# EAGLE design BT AQ DOL R7 (EAGLE 9.6.2)

## Sheet 1 of 2
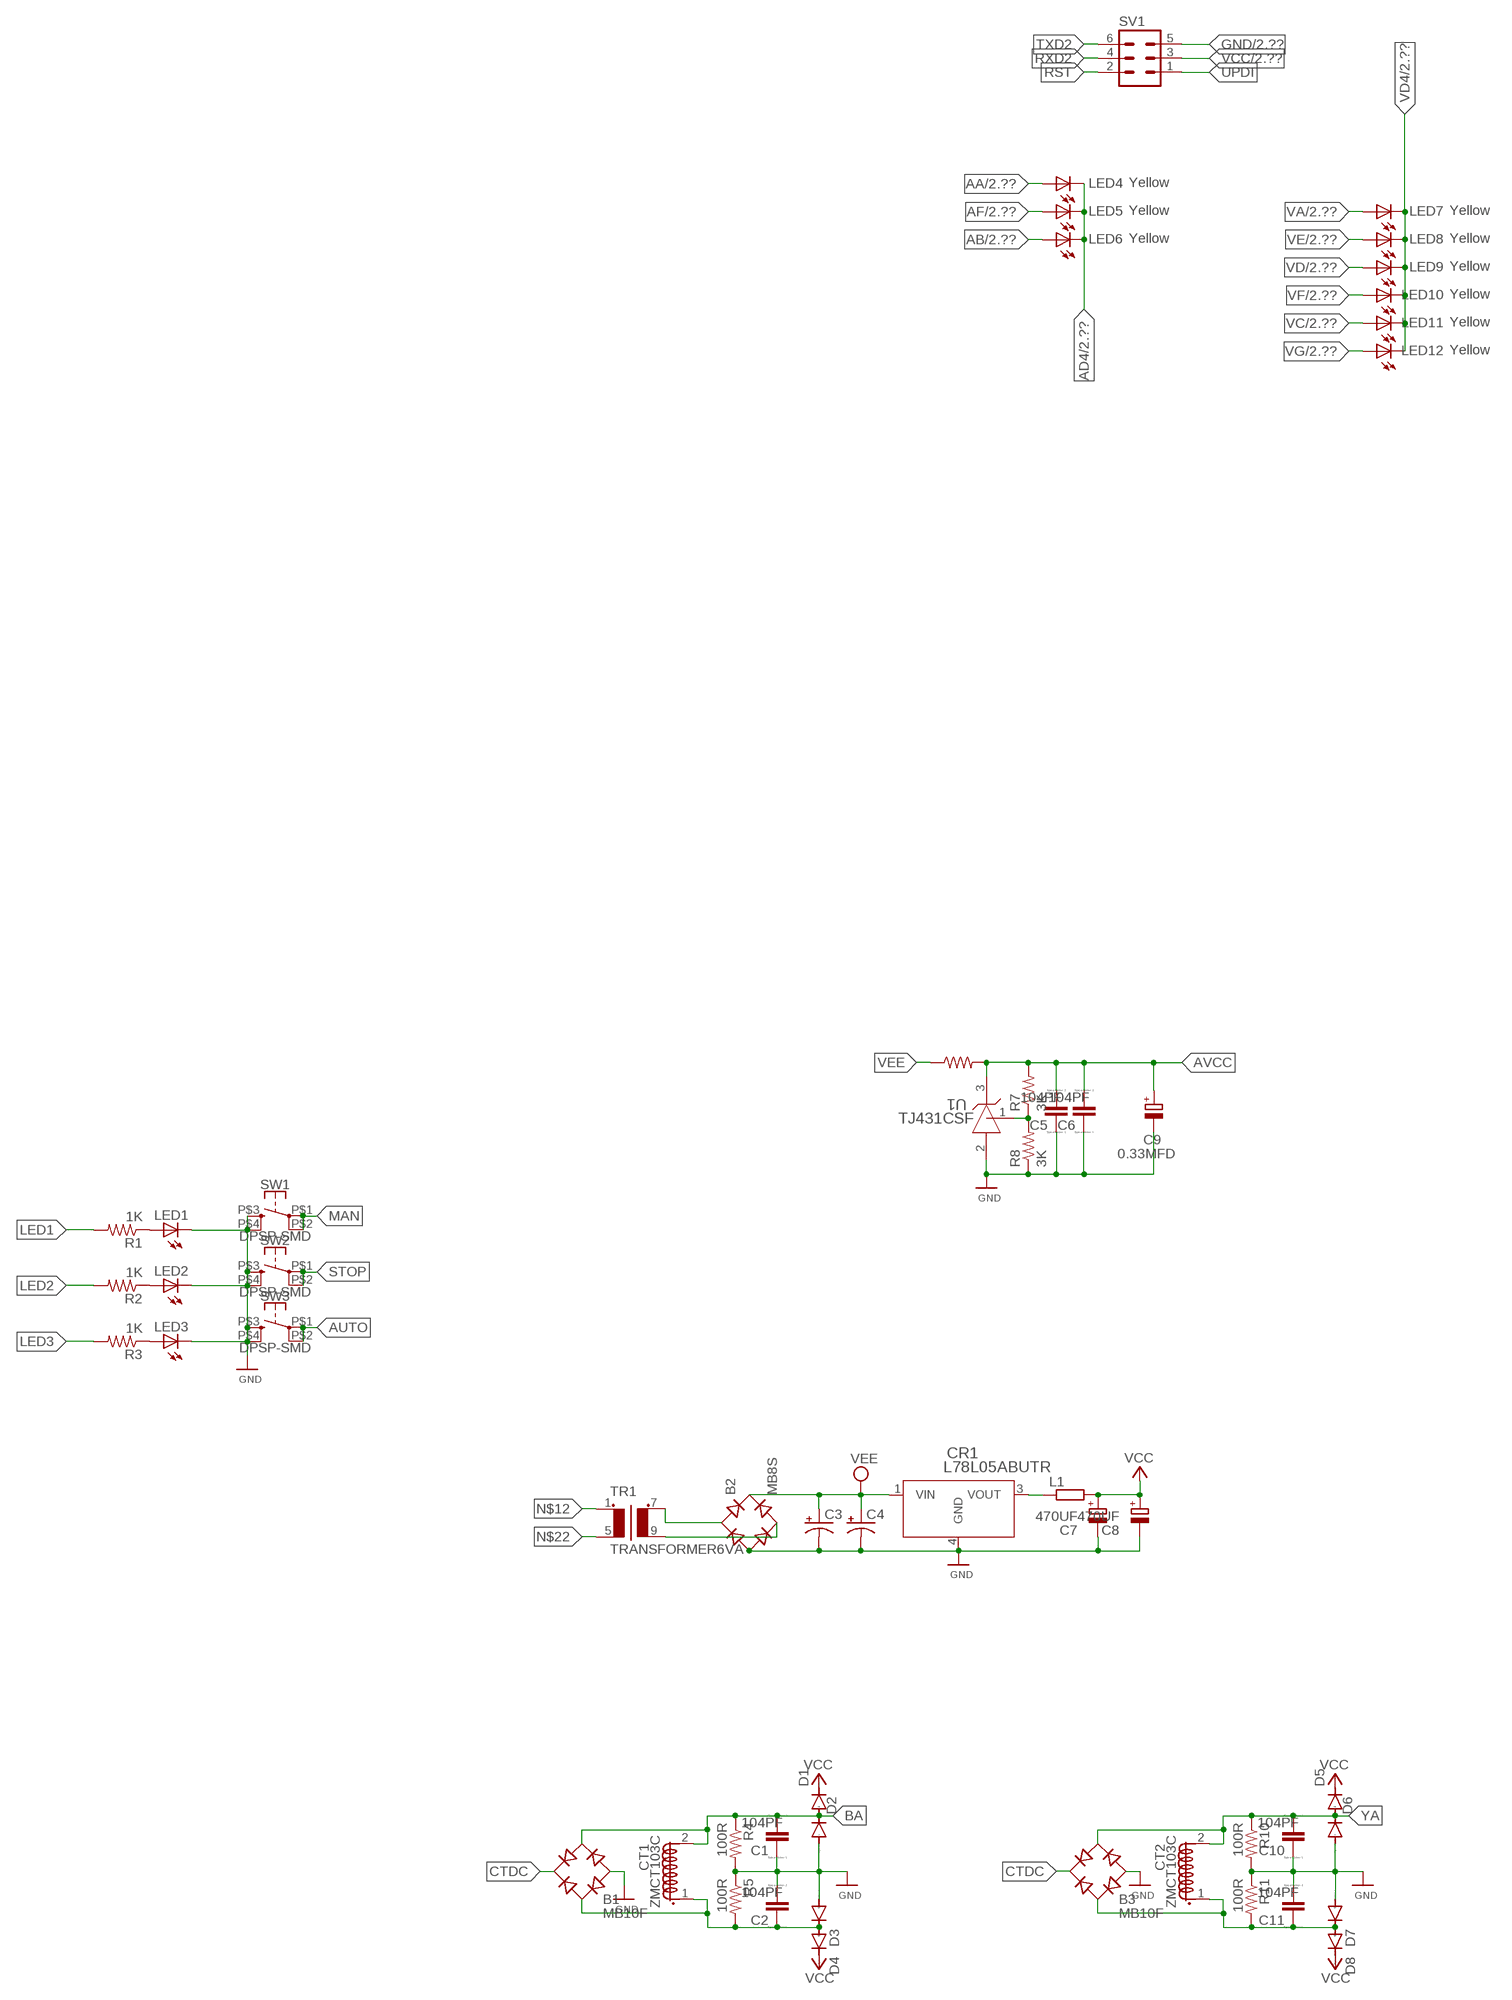
[diagram p0: schematic, sheet 1, part 1 of 3]
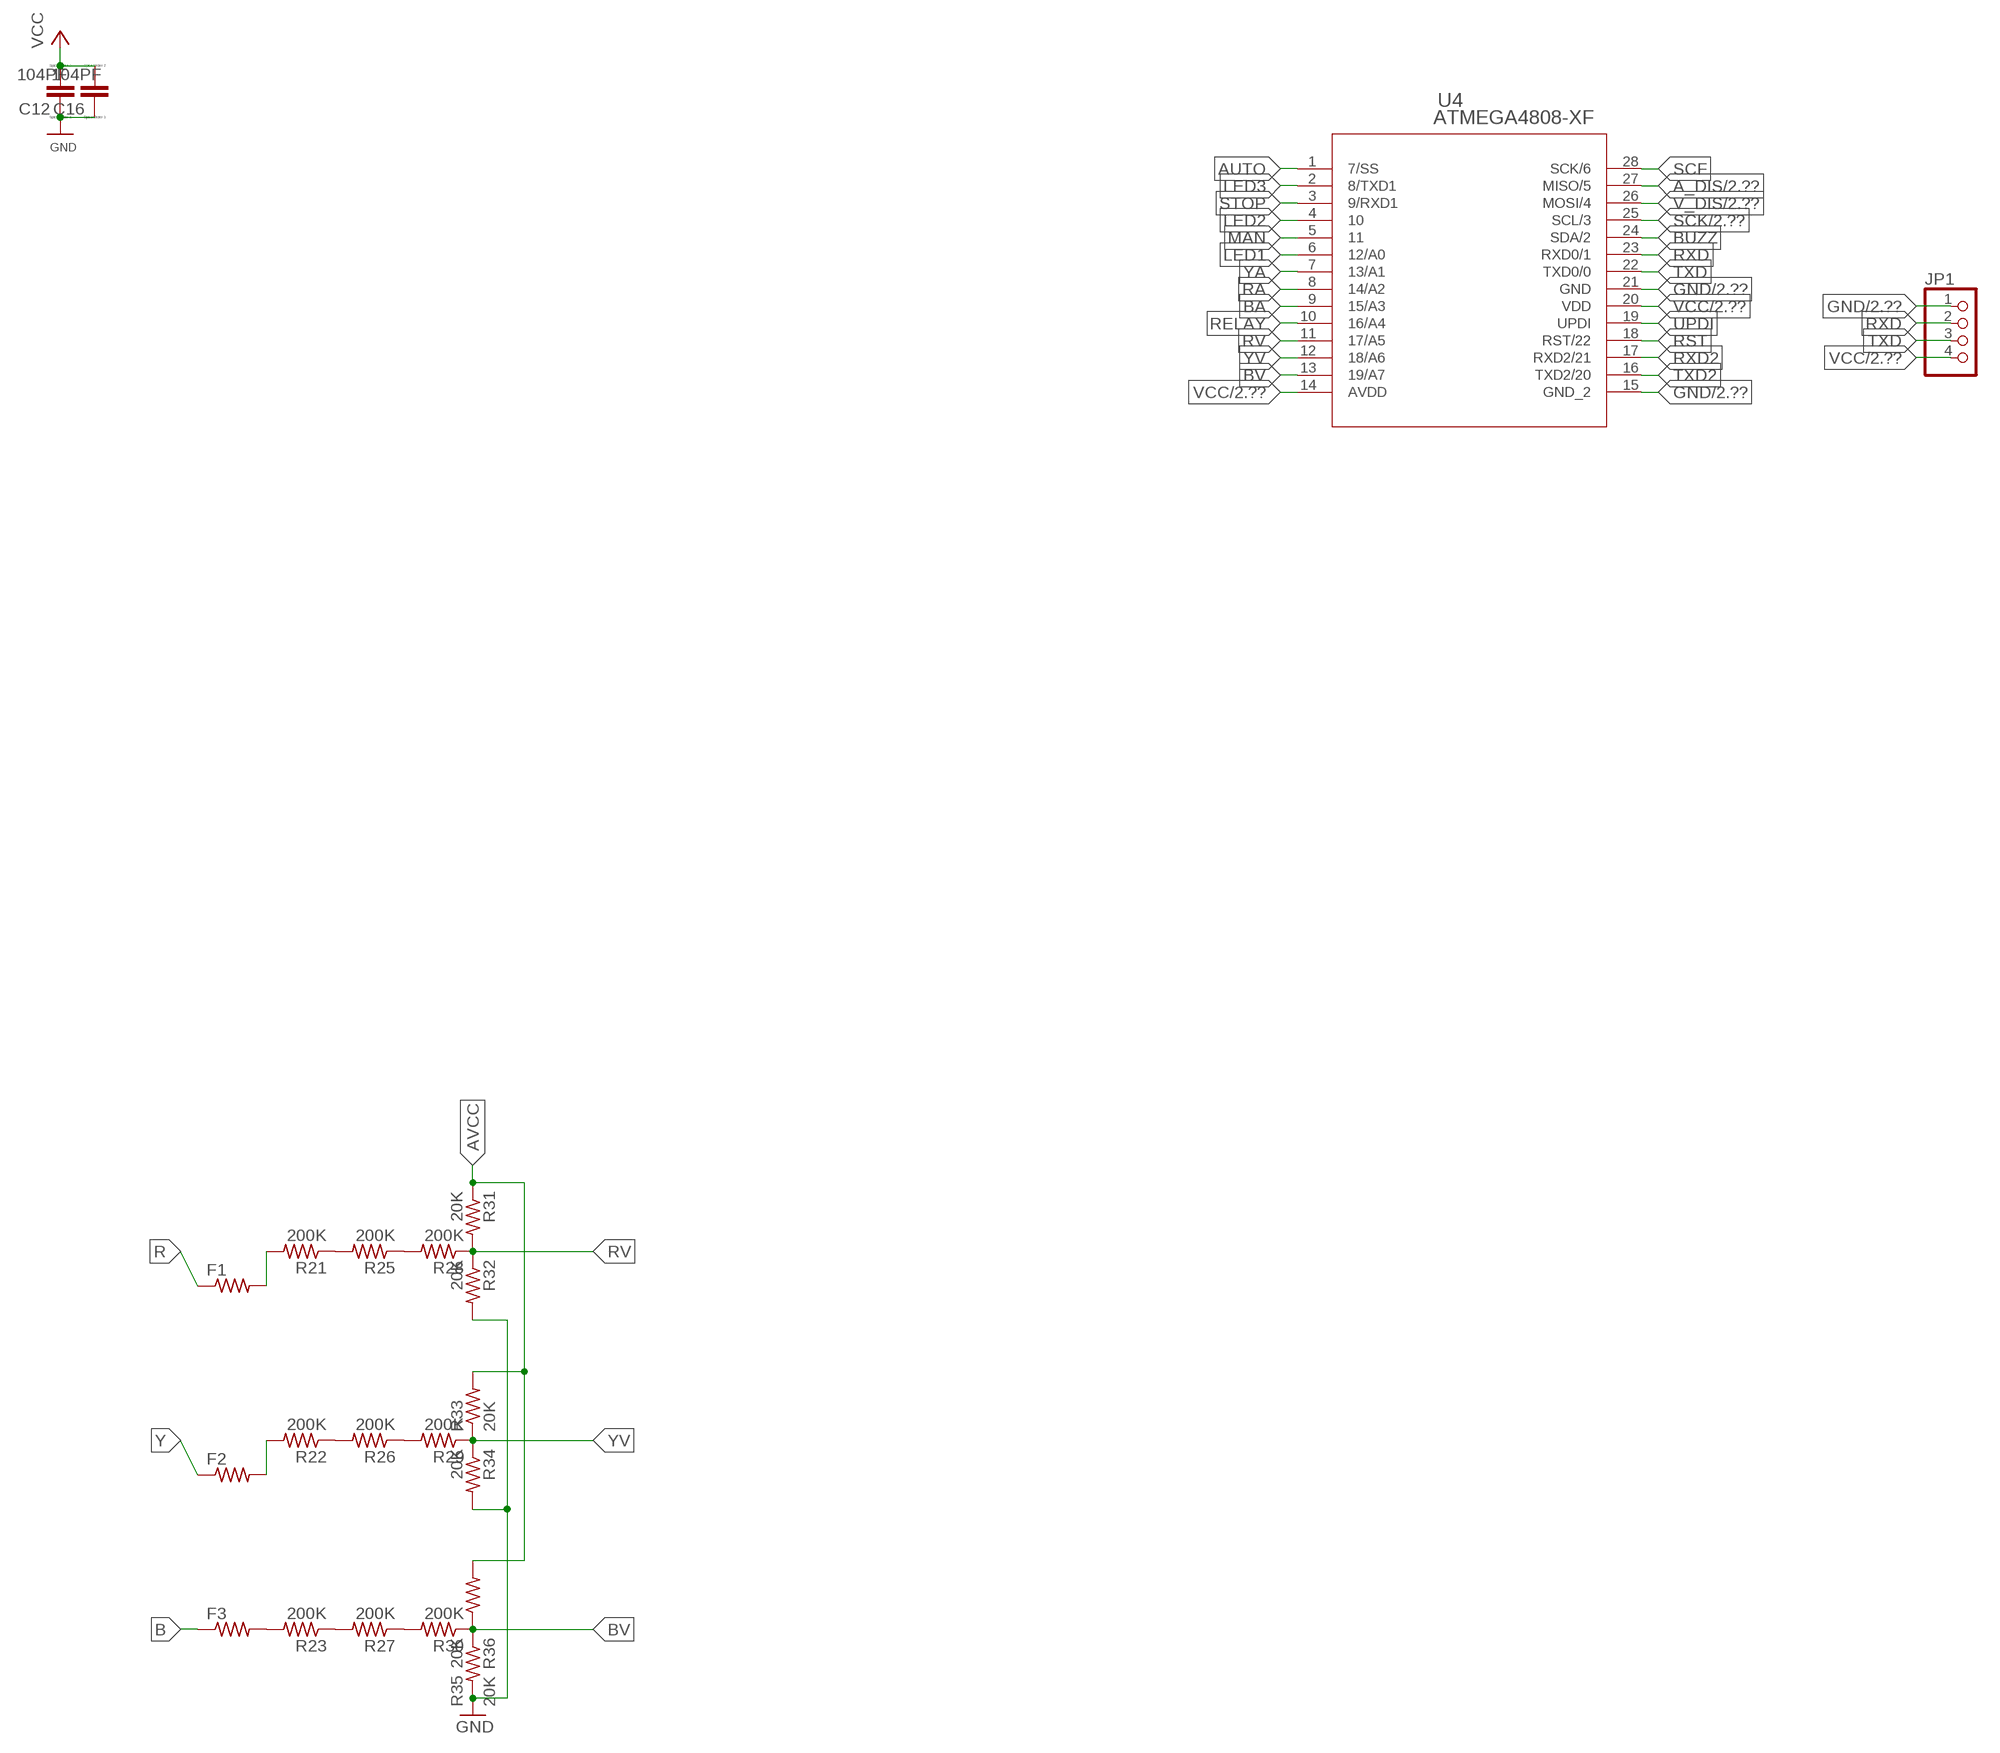
[diagram p1: schematic, sheet 1, part 2 of 3]
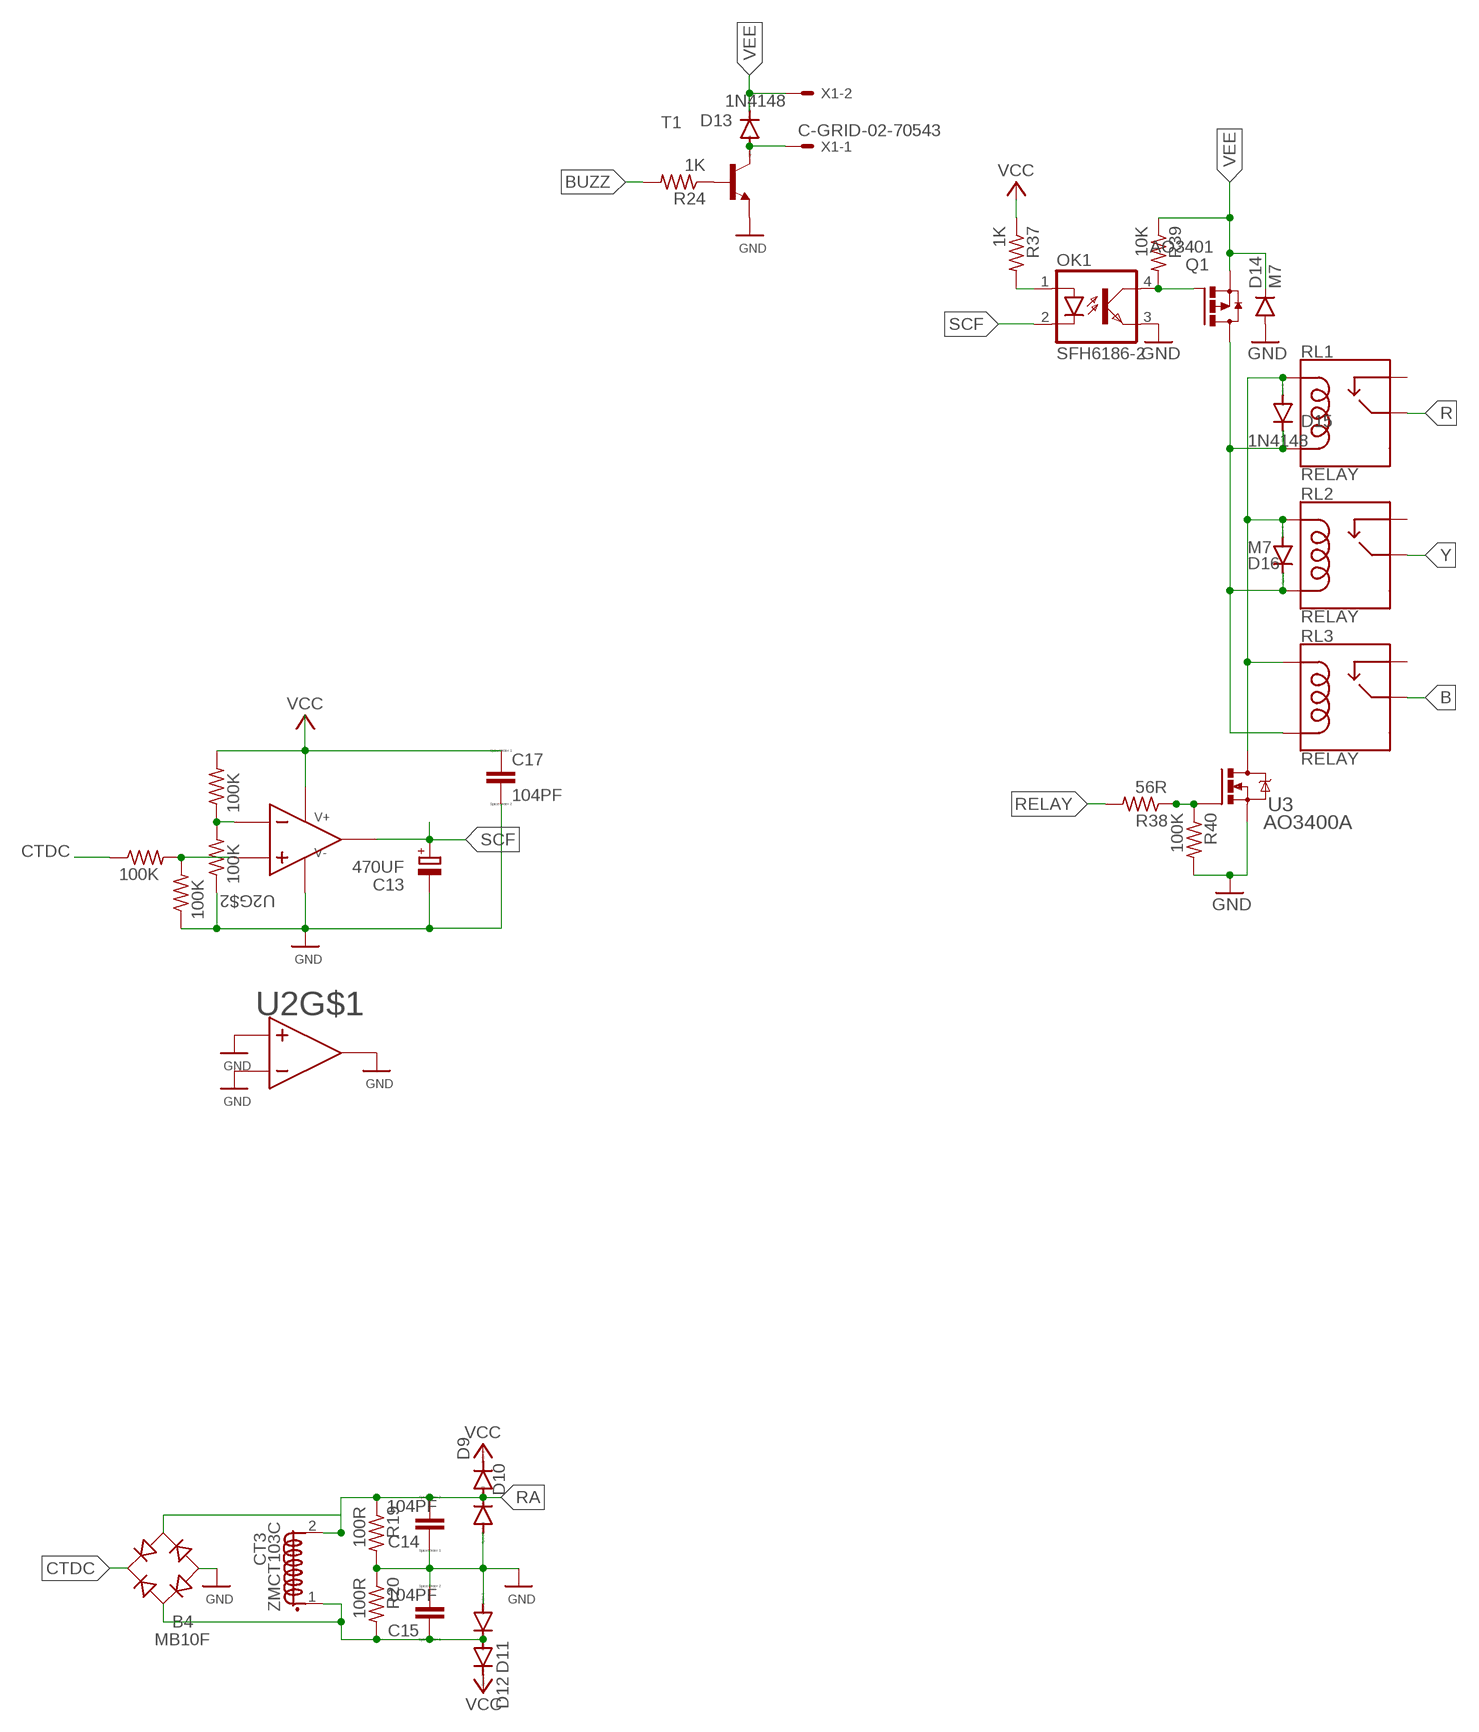
[diagram p2: schematic, sheet 1, part 3 of 3]

### Parts
B1  MB10F  MB8S  [SOIC-4]
B2  MB8S  [SOIC-4]
B3  MB10F  MB8S  [SOIC-4]
B4  MB10F  MB8S  [SOIC-4]
C1  104PF  CC1206  [C1206]
C2  104PF  CC1206  [C1206]
C3  CPOL-USE3.5-10  [E3,5-10]
C4  CPOL-USE3.5-10  [E3,5-10]
C5  104PF  CC1206  [C1206]
C6  104PF  CC1206  [C1206]
C7  470UF  CPOL-EUE3.5-8  [E3,5-8]
C8  470UF  CPOL-EUE3.5-8  [E3,5-8]
C9  0.33MFD  CPOL-EUE2.5-5  [E2,5-5]
C10  104PF  CC1206  [C1206]
C11  104PF  CC1206  [C1206]
C12  104PF  CC1206  [C1206]
C13  470UF  CPOL-EUE3.5-8  [E3,5-8]
C14  104PF  CC1206  [C1206]
C15  104PF  CC1206  [C1206]
C16  104PF  CC1206  [C1206]
C17  104PF  CC1206  [C1206]
CR1  L78L05ABUTR  [D2PAK]
CT1  ZMCT103C  CT18X10  [ZMCT103C]
CT2  ZMCT103C  CT18X10  [ZMCT103C]
CT3  ZMCT103C  CT18X10  [ZMCT103C]
D1  DIODE-DO214AC  [DO214AC]
D2  DIODE-DO214AC  [DO214AC]
D3  DIODE-DO214AC  [DO214AC]
D4  DIODE-DO214AC  [DO214AC]
D5  DIODE-DO214AC  [DO214AC]
D6  DIODE-DO214AC  [DO214AC]
D7  DIODE-DO214AC  [DO214AC]
D8  DIODE-DO214AC  [DO214AC]
D9  DIODE-DO214AC  [DO214AC]
D10  DIODE-DO214AC  [DO214AC]
D11  DIODE-DO214AC  [DO214AC]
D12  DIODE-DO214AC  [DO214AC]
D13  1N4148  DIODE-MINIMELF  [MINIMELF]
D14  M7  DIODEDO214AA  [DO-214AA]
D15  1N4148  DIODE-MINIMELF  [MINIMELF]
D16  M7  DIODE-DO214AC  [DO214AC]
F1  R-US_MELF0204W  [MINI_MELF-0204W]
F2  R-US_MELF0204W  [MINI_MELF-0204W]
F3  R-US_MELF0204W  [MINI_MELF-0204W]
JP1  PINHD-1X4  [1X04]
L1  R-EU_R0603  [R0603]
LED1  Blue  LED3MM  [LED3MM]
LED2  Blue  LED3MM  [LED3MM]
LED3  Blue  LED3MM  [LED3MM]
LED4  Yellow  LED3MM  [LED3MM]
LED5  Yellow  LED3MM  [LED3MM]
LED6  Yellow  LED3MM  [LED3MM]
LED7  Yellow  LED3MM  [LED3MM]
LED8  Yellow  LED3MM  [LED3MM]
LED9  Yellow  LED3MM  [LED3MM]
LED10  Yellow  LED3MM  [LED3MM]
LED11  Yellow  LED3MM  [LED3MM]
LED12  Yellow  LED3MM  [LED3MM]
OK1  SFH6186-2  [SMD4-7]
Q1  AO3401  FDN360P  [SUPER-SOT3]
R1  1K  R-US_M1206  [M1206]
R2  1K  R-US_M1206  [M1206]
R3  1K  R-US_M1206  [M1206]
R4  100R  R-US_M1206  [M1206]
R5  100R  R-US_M1206  [M1206]
R6  10K  R-US_M1206  [M1206]
R7  3K  R-US_M1206  [M1206]
R8  3K  R-US_M1206  [M1206]
R10  100R  R-US_M1206  [M1206]
R11  100R  R-US_M1206  [M1206]
R12  100K  R-US_M1206  [M1206]
R13  100K  R-US_M1206  [M1206]
R14  100K  R-US_M1206  [M1206]
R15  100K  R-US_M1206  [M1206]
R19  100R  R-US_M1206  [M1206]
R20  100R  R-US_M1206  [M1206]
R21  200K  R-US_M1206  [M1206]
R22  200K  R-US_M1206  [M1206]
R23  200K  R-US_M1206  [M1206]
R24  1K  R-US_M1206  [M1206]
R25  200K  R-US_M1206  [M1206]
R26  200K  R-US_M1206  [M1206]
R27  200K  R-US_M1206  [M1206]
R28  200K  R-US_M1206  [M1206]
R29  200K  R-US_M1206  [M1206]
R30  200K  R-US_M1206  [M1206]
R31  20K  R-US_M1206  [M1206]
R32  20K  R-US_M1206  [M1206]
R33  20K  R-US_M1206  [M1206]
R34  20K  R-US_M1206  [M1206]
R35  20K  R-US_M1206  [M1206]
R36  20K  R-US_M1206  [M1206]
R37  1K  R-US_M1206  [M1206]
R38  56R  R-US_M1206  [M1206]
R39  10K  R-US_M1206  [M1206]
R40  100K  R-US_M1206  [M1206]
RL1  RELAY  [DT81_RECTANGULAR]
RL2  RELAY  [DT81_RECTANGULAR]
RL3  RELAY  [DT81_RECTANGULAR]
SV1  MA03-2  [MA03-2]
SW1  DPSP-SMD  [B3F-40XX-ROUND-SMD]
SW2  DPSP-SMD  [B3F-40XX-ROUND-SMD]
SW3  DPSP-SMD  [B3F-40XX-ROUND-SMD]
T1  MMUN2213LT1-NPN-SC59-BEC  [SC59-BEC]
TR1  TRANSFORMER6VA  [440V12V6VA]
U1  TJ431CSF  TJ431CSFDBZ0003A_L  [SOT-23]
U2  LM393DG  [SOIC8_ONS]
U3  AO3400A  [SOT-23-3L_AOS]
U4  ATMEGA4808-XF  [SSOP28_SS_MCH]
X1  C-GRID-02-70543  [70543-02]

### Nets
A_DIS: U4.27(MISO/5) ; also sheet 2
AA: LED4.A ; also sheet 2
AB: LED6.A ; also sheet 2
AD4: LED4.K(C) LED5.K(C) LED6.K(C) ; also sheet 2
AF: LED5.A ; also sheet 2
AUTO: SW3.P$1 SW3.P$2 U4.1(7/SS)
AVCC: C5.2 C6.2 C9.+ R6.2 R7.2 R31.1 R33.2 R35.2 U1.3(CATHODE)
B: F3.1 RL3.C(MAIN) RL3.C.(MAIN)
BA: B1.~2(AC2) C1.2 CT1.2(S1.2) D1.A D2.C R4.1 U4.9(15/A3)
BUZZ: R24.2 U4.24(SDA/2)
BV: R30.1 R35.1 R36.1 U4.13(19/A7)
CTDC: B1.+ B3.+ B4.+ R12.1
GND: B1.- B2.- B3.- B4.- C1.1 C2.2 C3.- C4.- C5.1 C6.1 C7.- C8.- C9.- C10.1 C11.2 C12.1 C13.- C14.1 C15.2 C16.1 C17.2 CR1.4(GND) D2.A D3.A D6.A D7.A D10.A D11.A D14.A JP1.1 LED1.K(C) LED2.K(C) LED3.K(C) OK1.3(EMIT) R4.2 R5.1 R8.1 R10.2 R11.1 R13.1 R15.1 R19.2 R20.1 R32.2 R34.2 R36.2 R40.2 SV1.5 SW1.P$3 SW1.P$4 SW2.P$3 SW2.P$4 SW3.P$3 SW3.P$4 T1.E U1.2(ANODE) U2.1(1OUT) U2.2(1IN-) U2.3(1IN+) U2.4(GND) U3.S U4.15(GND_2) U4.21(GND) ; also sheet 2
LED1: R1.2 U4.6(12/A0)
LED2: R2.2 U4.4
LED3: R3.2 U4.2(8/TXD1)
MAN: SW1.P$1 SW1.P$2 U4.5
N$1: R25.1 R28.2
N$2: B2.~2(AC2) TR1.9(S2)
N$3: D13.A T1.C X1.1
N$4: R24.1 T1.B
N$5: R27.1 R30.2
N$6: R38.1 R40.1 U3.G
N$8: CR1.3(VOUT) L1.1
N$9: LED3.A R3.1
N$10: B2.~1(AC1) TR1.7(S1)
N$11: R21.1 R25.2
N$12: F1.2 R21.2 TR1.1
N$13: LED2.A R2.1
N$14: R22.1 R26.2
N$15: R23.1 R27.2
N$16: OK1.1(A) R37.2
N$17 [VEE]: D15.A D16.A RL1.1(COIL1) RL1.1.(COIL1) RL2.1(COIL1) RL2.1.(COIL1) RL3.1(COIL1) RL3.1.(COIL1) U3.D
N$18: OK1.4(COL) Q1.1(G) R39.2
N$19: R26.1 R29.2
N$20 [VEE]: D15.C D16.C Q1.3(D) RL1.2(COIL2) RL1.2.(COIL2) RL2.2(COIL2) RL2.2.(COIL2) RL3.2(COIL2) RL3.2.(COIL2)
N$21: R7.1 R8.2 U1.1(REF)
N$22: F2.2 R22.2 TR1.5(P2)
N$23: B1.~1(AC1) C2.1 CT1.1(S1.1) D3.C D4.A R5.2
N$24: F3.2 R23.2
N$33: LED1.A R1.1
N$47: B3.~1(AC1) C11.1 CT2.1(S1.1) D7.C D8.A R11.2
N$57: R12.2 R13.2 U2.5(2IN+)
N$62: B4.~1(AC1) C15.1 CT3.1(S1.1) D11.C D12.A R20.2
R: F1.1 RL1.C(MAIN) RL1.C.(MAIN)
RA: B4.~2(AC2) C14.2 CT3.2(S1.2) D9.A D10.C R19.1 U4.8(14/A2)
RELAY: R38.2 U4.10(16/A4)
RST: SV1.2 U4.18(RST/22)
RV: R28.1 R31.2 R32.1 U4.11(17/A5)
RXD: JP1.2 U4.23(RXD0/1)
RXD2: SV1.4 U4.17(RXD2/21)
SCF: C13.+ OK1.2(C) U2.7(2OUT) U4.28(SCK/6)
SCF_VCC: R14.1 R15.2 U2.6(2IN-)
SCK: U4.25(SCL/3) ; also sheet 2
STOP: SW2.P$1 SW2.P$2 U4.3(9/RXD1)
TXD: JP1.3 U4.22(TXD0/0)
TXD2: SV1.6 U4.16(TXD2/20)
UPDI: SV1.1 U4.19(UPDI)
V_DIS: U4.26(MOSI/4) ; also sheet 2
VA: LED7.A ; also sheet 2
VC: LED11.A ; also sheet 2
VCC: C7.+ C8.+ C12.2 C16.2 C17.1 D1.C D4.C D5.C D8.C D9.C D12.C JP1.4 L1.2 R14.2 R37.1 SV1.3 U2.8(VCC) U4.14(AVDD) U4.20(VDD) ; also sheet 2
VD: LED9.A ; also sheet 2
VD4: LED7.K(C) LED8.K(C) LED9.K(C) LED10.K(C) LED11.K(C) LED12.K(C) ; also sheet 2
VE: LED8.A ; also sheet 2
VEE [VEE]: B2.+ C3.+ C4.+ CR1.1(VIN) D13.C D14.C Q1.2(S) R6.1 R39.1 X1.2
VF: LED10.A ; also sheet 2
VG: LED12.A ; also sheet 2
Y: F2.1 RL2.C(MAIN) RL2.C.(MAIN)
YA: B3.~2(AC2) C10.2 CT2.2(S1.2) D5.A D6.C R10.1 U4.7(13/A1)
YV: R29.1 R33.1 R34.1 U4.12(18/A6)
Unconnected: RL1.NO(N0) RL1.NO.(N0) RL2.NO(N0) RL2.NO.(N0) RL3.NO(N0) RL3.NO.(N0)

## Sheet 2 of 2
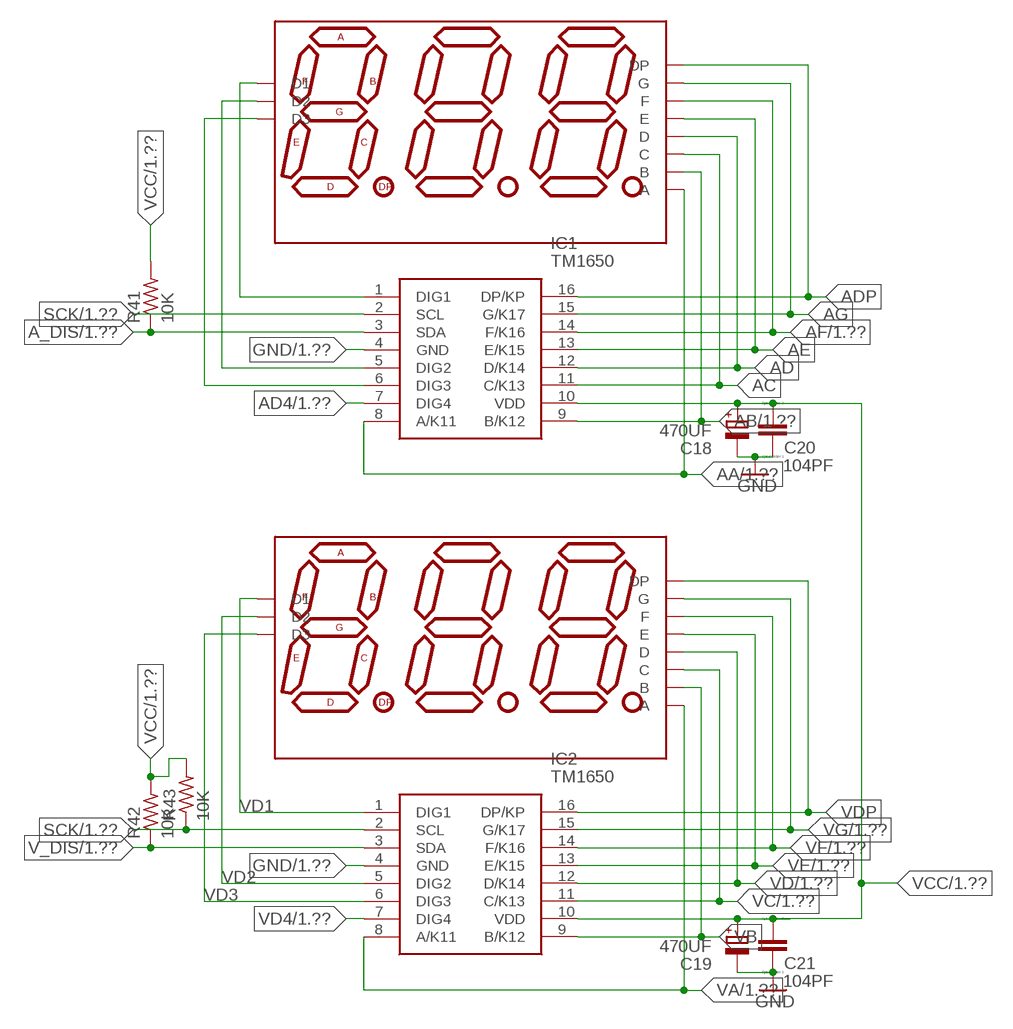
[diagram p3: schematic, sheet 2]

### Parts
C18  470UF  CPOL-EUE3.5-8  [E3,5-8]
C19  470UF  CPOL-EUE3.5-8  [E3,5-8]
C20  104PF  CC1206  [C1206]
C21  104PF  CC1206  [C1206]
D17  SUNR036CC3D  7SEGMENT-3DIGITDIP  [7S3D036_DIP]
D18  SUNR036CC3D  7SEGMENT-3DIGITDIP  [7S3D036_DIP]
IC1  TM1650  [SOIC127P604X185-16N]
IC2  TM1650  [SOIC127P604X185-16N]
R41  10K  R-US_M1206  [M1206]
R42  10K  R-US_M1206  [M1206]
R43  10K  R-US_M1206  [M1206]

### Nets
A_DIS: IC1.3(SDA) R41.1 ; also sheet 1
AA: D17.11(A) IC1.8(A/K11) ; also sheet 1
AB: D17.7(B) IC1.9(B/K12) ; also sheet 1
AC: D17.4(C) IC1.11(C/K13)
AD: D17.2(D) IC1.12(D/K14)
AD4: IC1.7(DIG4) ; also sheet 1
ADP: D17.3(DP) IC1.16(DP/KP)
AE: D17.1(E) IC1.13(E/K15)
AF: D17.10(F) IC1.14(F/K16) ; also sheet 1
AG: D17.5(G) IC1.15(G/K17)
GND: C18.- C19.- C20.1 C21.1 IC1.4(GND) IC2.4(GND) ; also sheet 1
N$74: D17.12(D1) IC1.1(DIG1)
N$75: D17.9(D2) IC1.5(DIG2)
N$76: D17.8(D3) IC1.6(DIG3)
SCK: IC1.2(SCL) IC2.2(SCL) R43.1 ; also sheet 1
V_DIS: IC2.3(SDA) R42.1 ; also sheet 1
VA: D18.11(A) IC2.8(A/K11) ; also sheet 1
VB: D18.7(B) IC2.9(B/K12)
VC: D18.4(C) IC2.11(C/K13) ; also sheet 1
VCC: C18.+ C19.+ C20.2 C21.2 IC1.10(VDD) IC2.10(VDD) R41.2 R42.2 R43.2 ; also sheet 1
VD: D18.2(D) IC2.12(D/K14) ; also sheet 1
VD1: D18.12(D1) IC2.1(DIG1)
VD2: D18.9(D2) IC2.5(DIG2)
VD3: D18.8(D3) IC2.6(DIG3)
VD4: IC2.7(DIG4) ; also sheet 1
VDP: D18.3(DP) IC2.16(DP/KP)
VE: D18.1(E) IC2.13(E/K15) ; also sheet 1
VF: D18.10(F) IC2.14(F/K16) ; also sheet 1
VG: D18.5(G) IC2.15(G/K17) ; also sheet 1

## Library data of the parts
B1-B4 = rectifier:MB*S: Bridge Rectifier Source: http://www.fairchildsemi.com/ds/MB/MB6S.pdf
C1 C2 C5 C6 C10-C12 C14-C17 C20 C21 = eagle-ltspice:C: CAPACITOR, European symbol; SPICEMODEL: NONE; SPICEPREFIX: C
C3 C4 = rcl:CPOL-US: POLARIZED CAPACITOR, American symbol; SPICEPREFIX: C
C7-C9 C13 C18 C19 = rcl:CPOL-EU: POLARIZED CAPACITOR, European symbol; SPICEPREFIX: C
CR1 = User Components:L78L05ABUTR
CT1-CT3 = User Components:CT
D1-D13 D15 D16 = diode:DIODE-: DIODE
D14 = BeagleBone_Blue_R3:DIODE: Diode These are standard reverse protection diodes and small signal diodes. SMA package can handle up to about 1A. SOD-323 can handle about 200mA. What the SOD-323 package when ordering, there are some mfgs out there that are 5-pin packages.
D17 D18 = User Components:7SEGMENT-3DIGIT
F1-F3 R21-R43 = rcl:R-US_: RESISTOR, American symbol; SPICEPREFIX: R
IC1 IC2 = User Components:TM1650: The TM1650 is a dedicated LED (LED display) drive control circuit with a keyboard scan interface. The MCU input and output control digital interface, data latch, LED driver, keyboard scan, brightness adjustment and other circuits are integrated inside. The TM1650's stable performance, reliable quality, and high immunity to interference make it suitable for long-term continuous operation in 24 hours Source: Datasheet <http://www.titanmec.com/index.php/en/product/download/id/540.html>; DESCRIPTION: The TM1650 is a dedicated LED (LED display) drive control circuit with a keyboard scan interface. The MCU input and output control digital interface, data latch, LED driver, keyboard scan, brightness adjustment and other circuits are integrated inside. The TM1650's stable performance, reliable quality, and high immunity to interference make it suitable for long-term continuous operation in 24 hours; HEIGHT: 1.85mm; MANUFACTURER_NAME: TITAN MICRO ELECTRONICS; MANUFACTURER_PART_NUMBER: tm1650
JP1 = User Components:PINHD-1X4: PIN HEADER
L1 = rcl:R-EU_: RESISTOR, European symbol; SPICEPREFIX: R
LED1-LED12 = adafruit:LED: LED OSRAM: - CHIPLED LG R971, LG N971, LY N971, LG Q971, LY Q971, LO R971, LY R971 LH N974, LH R974 LS Q976, LO Q976, LY Q976 LO Q996 - Hyper CHIPLED LW Q18S LB Q993, LB Q99A, LB R99A - SideLED LS A670, LO A670, LY A670, LG A670, LP A670 LB A673, LV A673, LT A673, LW A673 LH A674 LY A675 LS A676, LA A676, LO A676, LY A676, LW A676 LS A679, LY A679, LG A679 - Hyper Micro SIDELED® LS Y876, LA Y876, LO Y876, LY Y876 LT Y87S - SmartLED LW L88C, LW L88S LB L89C, LB L89S, LG L890 LS L89K, LO L89K, LY L89K LS L896, LA L896, LO L896, LY L896 - TOPLED LS T670, LO T670, LY T670, LG T670, LP T670 LSG T670, LSP T670, LSY T670, LOP T670, LYG T670 LG T671, LOG T671, LSG T671 LB T673, LV T673, LT T673, LW T673 LH T674 LS T676, LA T676, LO T676, LY T676, LB T676, LH T676, LSB T676, LW T676 LB T67C, LV T67C, LT T67C, LS T67K, LO T67K, LY T67K, LW E67C LS E67B, LA E67B, LO E67B, LY E67B, LB E67C, LV E67C, LT E67C LW T67C LS T679, LY T679, LG T679 LS T770, LO T770, LY T770, LG T770, LP T770 LB T773, LV T773, LT T773, LW T773 LH T774 LS E675, LA E675, LY E675, LS T675 LS T776, LA T776, LO T776, LY T776, LB T776 LHGB T686 LT T68C, LB T68C - Hyper Mini TOPLED® LB M676 - Mini TOPLED Santana® LG M470 LS M47K, LO M47K, LY M47K Source: http://www.osram.convergy.de/
OK1 = optocoupler:SFH618?*: Optocoupler, Phototransistor Output, Low Input Current Source: Data sheet <http://www.vishay.com/docs/83673/sfh618.pdf>; MF: VISHAY/TELEFUNKEN; MPN: SFH6186-2; OC_FARNELL: 1469583; OC_NEWARK: 58K2210
Q1 = transistor-power:FDN360P: Single P-Channel, PowerTrench (R) MOSFET Source: http://www.fairchildsemi.com/ds/FD/FDN360P.pdf
R1-R8 R10-R15 R19 R20 = rcl:R-US_: RESISTOR, American symbol
RL1-RL3 = User Components:RELAY
SV1 = con-lstb:MA03-2: PIN HEADER; OC_FARNELL: unknown; OC_NEWARK: unknown
SW1-SW3 = User Components:DPSP-SMD
T1 = transistor:*-NPN-: NPN Transistror BF959 corrected 2008.03.06
TR1 = User Components:TRANSFORMER
U1 = User Components:TJ431CSF; COPYRIGHT: Copyright (C) 2022 Ultra Librarian. All rights reserved.; MANUFACTURER_PART_NUMBER: TL431IDBZTG4; MFR_NAME: Texas Instruments; REFDES: RefDes; TYPE: TYPE
U2 = User Components:LM393DG; COPYRIGHT: Copyright (C) 2022 Ultra Librarian. All rights reserved.; MANUFACTURER_PART_NUMBER: LM393DG; MFR_NAME: onsemi
U3 = User Components:AO3400A; COPYRIGHT: Copyright (C) 2024 Ultra Librarian. All rights reserved.; MANUFACTURER_PART_NUMBER: AO3400A; MFR_NAME: Alpha and Omega Semiconductor
U4 = User Components:ATMEGA4808-XF; COPYRIGHT: Copyright (C) 2022 Ultra Librarian. All rights reserved.; MANUFACTURER_PART_NUMBER: ATMEGA4808-XF; MFR_NAME: Microchip
X1 = con-molex:C-GRID-02: CONNECTOR wire to board 2.54 mm (0.100") pitch header; MF: MOLEX; OC_FARNELL: unknown; OC_NEWARK: unknown

## Net classes
0 default: width 0.254 mm, drill 0.508 mm, clearance 0.279 mm
1 VEE: width 0.762 mm, drill 0.508 mm, clearance 0.508 mm

## Board
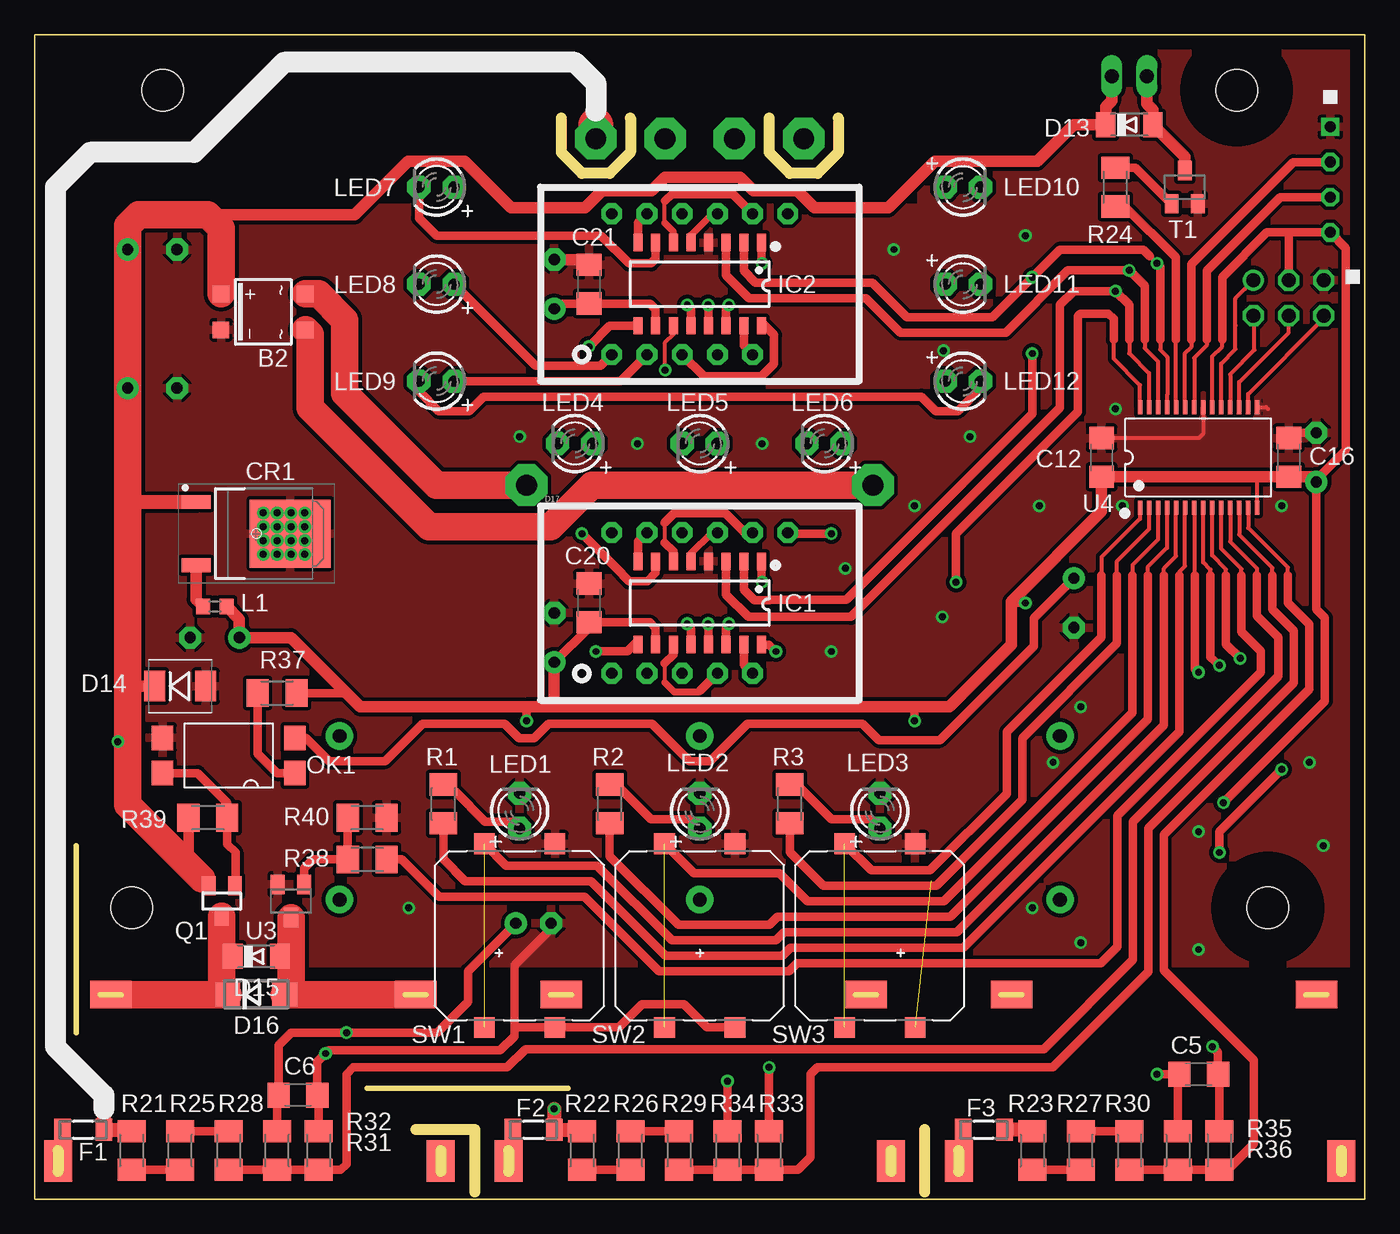
[diagram p4: board, top side]
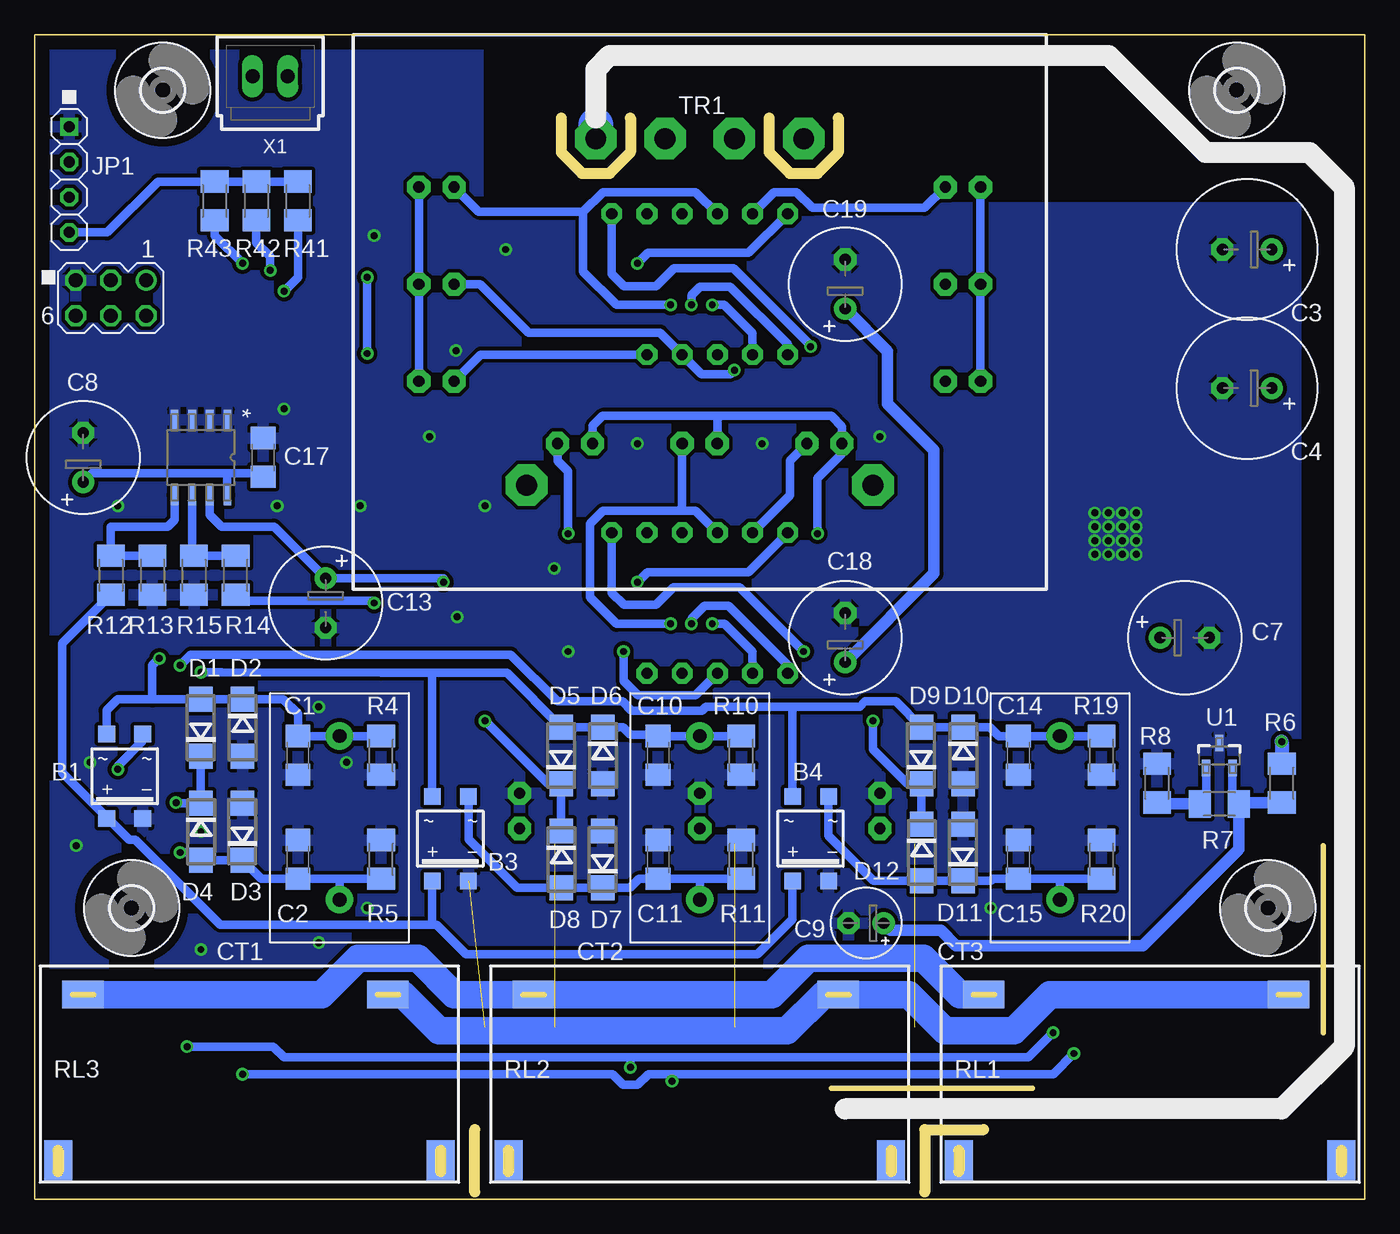
[diagram p5: board, bottom side, seen from below]

Size 96 x 84 mm. Coordinates in mm from the lower left corner, seen from the top.
Outline: 96,0 96,84 0,84 0,0 96,0
Copper layers (1*16): Top 0.035mm / dielectric 1.5mm / Bottom 0.035mm
Design rules "default *": minimum track width 6mil, minimum drill 0.35mm, track to track 6mil, track to pad 6mil, pad to pad 6mil, via to via 6mil, smd to smd 6mil, copper to edge 40mil, drill to drill 6mil, minimum pad ring 10mil, minimum via ring 8mil, stop-mask expansion 4mil, vias tented up to drill 20mil, thermal gap 10mil
Milling: 15 lines

### Footprints (pad centres in the part's own frame; a part is rotated, then mirrored left to right if it is on the bottom)
SOIC-4 = smd 1.2 x 1.2: + 1.3,3.05; - -1.3,3.05; ~1 -1.3,-3.05; ~2 1.3,-3.05
C1206 = smd 1.6 x 1.8: 1 -1.4,0; 2 1.4,0
E3,5-10 = drill 0.813 pad 1.6: + -1.778,0 | drill 0.813 pad 1.6 octagon: - 1.778,0
E3,5-8 = drill 0.813 pad 1.6: + -1.778,0 | drill 0.813 pad 1.6 octagon: - 1.778,0
E2,5-5 = drill 0.813 pad 1.6: + -1.27,0 | drill 0.813 pad 1.6 octagon: - 1.27,0
D2PAK = smd 2.1 x 1: 1 -4.35,2.28; 3 -4.35,-2.28 | smd 5.85 x 4.9: 4 2.45,0
ZMCT103C = drill 1 pad 2: 1 -5.9,0; 2 5.9,0
DO214AC = smd 1.8 x 1.7: A 2.05,0; C -2.05,0
MINIMELF = smd 1.4 x 1.8: A 1.7,0; C -1.7,0
DO-214AA = smd 1.524 x 2.184: A 1.841,0; C -1.841,0
7S3D036_DIP = drill 0.8 pad 1.5 octagon: 1 -6.35,-5.08; 2 -3.81,-5.08; 3 -1.27,-5.08; 4 1.27,-5.08; 5 3.81,-5.08; 7 6.35,5.08; 8 3.81,5.08; 9 1.27,5.08; 10 -1.27,5.08; 11 -3.81,5.08; 12 -6.35,5.08
MINI_MELF-0204W = smd 1.2 x 1.6: 1 -1.5,0; 2 1.5,0
SOIC127P604X185-16N = smd 1.25 x 0.65: 1 -3,4.445; 2 -3,3.175; 3 -3,1.905; 4 -3,0.635; 5 -3,-0.635; 6 -3,-1.905; 7 -3,-3.175; 8 -3,-4.445; 9 3,-4.445; 10 3,-3.175; 11 3,-1.905; 12 3,-0.635; 13 3,0.635; 14 3,1.905; 15 3,3.175; 16 3,4.445
1X04 = drill 0.8 square: 1 -6.35,0 | drill 0.8 octagon: 2 -3.81,0; 3 -1.27,0; 4 1.27,0
R0603 = smd 1 x 1.1: 1 -0.85,0; 2 0.85,0
LED3MM = drill 0.813 pad 1.676 octagon: A -1.27,0; K 1.27,0
SMD4-7 = smd 1.78 x 1.55: 1 -1.27,-4.77; 2 1.27,-4.77; 3 1.27,4.77; 4 -1.27,4.77
SUPER-SOT3 = smd 1 x 1.4: 1 -0.95,-1.1; 2 0.95,-1.1; 3 0,1.1
M1206 = smd 1.6 x 2: 1 -1.4,0; 2 1.4,0
DT81_RECTANGULAR = smd 3 x 2: 1 12,-5.75; 2 -10,-5.75 | smd 3 x 2 bottom: 1. 12,-5.75; 2. -10,-5.75 | smd 2 x 3: C -13.8,6.25; NO 13.8,6.25 | smd 2 x 3 bottom: C. -13.8,6.25; NO. 13.8,6.25
MA03-2 = drill 1.016: 1 -2.54,-1.27 | drill 1.016 octagon: 2 -2.54,1.27; 3 0,-1.27; 4 0,1.27; 5 2.54,-1.27; 6 2.54,1.27
B3F-40XX-ROUND-SMD = smd 1.5 x 1.5: P$1 -6.62,2.54; P$2 6.62,2.54; P$3 -6.62,-2.54; P$4 6.62,-2.54
SC59-BEC = smd 1 x 1.4: B -0.95,-1.2; C 0,1.2; E 0.95,-1.2
440V12V6VA = drill 1.5 pad 3 octagon: 1 -12.5,7.5; 2 -12.5,2.5; 3 -12.5,-2.5; 5 -12.5,-7.5; 7 12.5,-12.5; 9 12.5,12.5
SOT-23 = smd 0.6 x 1.2: 1 -0.95,-0.9; 2 0,0.9; 3 0.95,-0.9
SOIC8_ONS = smd 1.499 x 0.559: 1 -2.705,1.905; 2 -2.705,0.635; 3 -2.705,-0.635; 4 -2.705,-1.905; 5 2.705,-1.905; 6 2.705,-0.635; 7 2.705,0.635; 8 2.705,1.905
SOT-23-3L_AOS = smd 1 x 1.4: D 0,1.2; G -0.95,-1.2; S 0.95,-1.2
SSOP28_SS_MCH = smd 1 x 0.3: 1 -3.632,4.225; 2 -3.632,3.575; 3 -3.632,2.925; 4 -3.632,2.275; 5 -3.632,1.625; 6 -3.632,0.975; 7 -3.632,0.325; 8 -3.632,-0.325; 9 -3.632,-0.975; 10 -3.632,-1.625; 11 -3.632,-2.275; 12 -3.632,-2.925; 13 -3.632,-3.575; 14 -3.632,-4.225; 15 3.632,-4.225; 16 3.632,-3.575; 17 3.632,-2.925; 18 3.632,-2.275; 19 3.632,-1.625; 20 3.632,-0.975; 21 3.632,-0.325; 22 3.632,0.325; 23 3.632,0.975; 24 3.632,1.625; 25 3.632,2.275; 26 3.632,2.925; 27 3.632,3.575; 28 3.632,4.225
3,0 = hole 3: 0,0
70543-02 = drill 1.016 long: 1 -1.27,0; 2 1.27,0

### Placement (x,y rotation side)
B1  89.5,30.5 180 bottom
B2  16.5,64 90 top
B3  66,26 180 bottom
B4  40,26 180 bottom
C1  77,32 90 bottom
C2  77,24.5 90 bottom
C3  8.5,68.5 180 bottom
C4  8.5,58.5 180 bottom
C5  84,9 0 top
C6  19,7.5 180 top
C7  13,40.5 0 bottom
C8  92.5,53.5 90 bottom
C9  36,19.9 180 bottom
C10  51,32 90 bottom
C11  51,24.5 90 bottom
C12  77,53.5 270 top
C13  75,43 270 bottom
C14  25,32 90 bottom
C15  25,24.5 90 bottom
C16  90.5,53.5 270 top
C17  79.5,53.5 90 bottom
C18  37.5,40.5 90 bottom
C19  37.5,66 90 bottom
C20  40,43 270 top
C21  40,66 270 top
CR1  16,48 0 top
CT1  74,27.5 90 bottom
CT2  48,27.5 90 bottom
CT3  22,27.5 90 bottom
D1  84,34 90 bottom
D2  81,34 270 bottom
D3  81,26.5 90 bottom
D4  84,26.5 270 bottom
D5  58,32 90 bottom
D6  55,32 270 bottom
D7  55,24.5 90 bottom
D8  58,24.5 270 bottom
D9  32,32 90 bottom
D10  29,32 270 bottom
D11  29,25 90 bottom
D12  32,25 270 bottom
D13  79,77.5 0 top
D14  10.5,37 0 top
D15  16,17.5 0 top
D16  16,14.75 0 top
D17  48,43 0 top
D18  48,66 0 top
F1  3.5,5 0 top
F2  36,5 0 top
F3  68.5,5 0 top
IC1  48,43 270 top
IC2  48,66 270 top
JP1  93.5,71 270 bottom
L1  13,42.75 0 top
LED1  35,28 90 top
LED2  48,28 90 top
LED3  61,28 90 top
LED4  39,54.5 180 top
LED5  48,54.5 180 top
LED6  57,54.5 180 top
LED7  29,73 180 top
LED8  29,66 180 top
LED9  29,59 180 top
LED10  67,73 0 top
LED11  67,66 0 top
LED12  67,59 0 top
OK1  14,32 90 top
Q1  13.5,21.5 180 top
R1  29.5,28.5 270 top
R2  41.5,28.5 270 top
R3  54.5,28.5 270 top
R4  71,32 270 bottom
R5  71,24.5 270 bottom
R6  6,30 270 bottom
R7  10.5,28.5 0 bottom
R8  15,30 270 bottom
R10  45,32 270 bottom
R11  45,24.5 270 bottom
R12  90.5,45 90 bottom
R13  87.5,45 90 bottom
R14  81.5,45 270 bottom
R15  84.5,45 90 bottom
R19  19,32 270 bottom
R20  19,24.5 270 bottom
R21  7,3.5 90 top
R22  39.5,3.5 90 top
R23  72,3.5 90 top
R24  78,73 270 top
R25  10.5,3.5 270 top
R26  43,3.5 270 top
R27  75.5,3.5 270 top
R28  14,3.5 90 top
R29  46.5,3.5 90 top
R30  79,3.5 90 top
R31  17.5,3.5 270 top
R32  20.5,3.5 90 top
R33  53,3.5 90 top
R34  50,3.5 90 top
R35  85.5,3.5 90 top
R36  82.5,3.5 90 top
R37  17.5,36.5 180 top
R38  24,24.5 0 top
R39  12.5,27.5 0 top
R40  24,27.5 0 top
R41  77,72 90 bottom
R42  80,72 90 bottom
R43  83,72 90 bottom
RL1  15.5,9 180 bottom
RL2  48,9 180 bottom
RL3  80.5,9 180 bottom
SV1  90.5,65 180 bottom
SW1  35,19 90 top
SW2  48,19 90 top
SW3  61,19 90 top
T1  83,73 0 top
TR1  48,64 270 bottom
U1  10.5,32 0 bottom
U2  84,53.5 270 bottom
U3  18.5,21.5 180 top
U4  84,53.5 90 top
U$5  [3,0]  86.75,80 0 bottom
U$6  [3,0]  9.25,80 0 bottom
U$11  [3,0]  89,21 0 bottom
U$12  [3,0]  7,21 0 bottom
X1  79,81 0 bottom

### Tracks (layer width: path | path; a pad name or v marks a point on that pad's centre or on a via)
A_DIS  (via drill 0.5)
  Top 0.305: U4.27 80.42,59.58 79,61.01 79,62
  Top 0.61: IC1.3 49.91,43.59 51.5,42 58.92,42 74,57.08 74,64.5 74.99,65.49 v78,65.5 79,64.5 79,62
  Bottom 0.61: R41.1 77,66.5 v78,65.5
AA
  Top 0.61: IC1.8 43.55,47.45 D17.11
  Bottom 0.61: LED4.A 41.5,53.27 41.5,50.77 D17.11
AB  (via drill 0.5)
  Top 0.61: v40.5,39.5 42.79,39.5 43.55,40.27 IC1.9 | v57.5,48 54.43,48 D17.7
  Bottom 0.61: D17.7 54.35,43.73 53.47,42.86 51.14,42.86 49.88,44.12 45.12,44.12 v40.5,39.5 | v57.5,48 57.5,52.5 58.27,53.27 LED6.A
AC
  Top 0.305: 45.46,38.65 45.46,37.27
  Top 0.508: 45.46,37.27 46.17,36.56 47.91,36.56 48.01,36.66
  Top 0.61: D17.4 48.01,36.66 | IC1.11 46.09,39.28 45.46,38.65
AD  (via drill 0.5)
  Top 0.61: v47.1,41.5 47.36,41.14 47.36,41.03 47.37,41.02 IC1.12
  Bottom 0.61: D17.2 44.19,39.48 46.21,41.5 v47.1,41.5
AD4  (via drill 0.5)
  Top 0.61: IC1.7 44.83,45.17 44.22,44.56 42.89,44.56 42.42,45.04 42.42,45.08 v39.5,48
  Bottom 0.61: LED6.K 55.73,55.77 55,56.5 46.5,56.5 | 46.5,56.5 38.5,56.5 37.73,55.73 LED4.K 37.73,53.77 39.5,52 v39.5,48 | LED5.K 46.73,56.27 46.5,56.5
ADP  (via drill 0.5)
  Top 0.61: v53.5,39.5 53,40 IC1.16
  Bottom 0.61: v53.5,39.5 53.5,37.4 52.46,36.36 48.29,36.36 D17.3
AE  (via drill 0.5)
  Top 0.61: v48.6,41.5 48.63,41.37 IC1.13
  Bottom 0.61: D17.1 41.65,38.52 45.94,42.81 47.64,42.81 48.6,41.86 v48.6,41.5
AF  (via drill 0.5)
  Top 0.61: v50.1,41.5 49.91,41.41 IC1.14
  Bottom 0.61: v50.1,41.5 54.02,41.5 55.91,43.4 55.91,48.73 55,49.64 49.5,49.64 | 49.5,49.64 48.29,49.64 D17.10 | LED5.A 49.27,49.87 49.5,49.64
AG
  Top 0.61: D17.5 51.17,38.55 IC1.15
AUTO  (1 unrouted)
  Top 0.305: 77,45 77,46.3 79.78,49.07 U4.1
  Top 0.61: 77,45 77,40.54 70.17,33.72 70.17,29.25 64.62,23.71 60.37,23.71 SW3.P$2
AVCC  (via drill 0.5)
  Top 0.61: R31.1 17.5,7.4 C6.2 17.6,11.1 18.5,12 v22.5,12 29.04,12 31.27,14.23 31.27,16.44 C9.+ | v85,11 85.4,10.6 C5.2 85.5,8.9 R35.2 | R33.2 v53,9.5
  Bottom 0.61: v53,9.5 53,10.23 | 53,10.23 78,10.23 78.77,11 v85,11 | U1.3 9.55,28.95 R7.2 | v22.5,12 24.27,10.23 53,10.23
  Bottom 0.813: C9.+ 34.23,19.4 30.61,19.4 29.5,18.29 16.04,18.29 9.1,25.22 R7.2 9,28.6 R6.2
B  (1 unrouted)
  Top 0.813: 67,3.05 RL3.C.
  Top 1.016: F3.1 67,3.05
BA  (via drill 0.5)
  Top 0.305: 85.97,45 85.97,45.43 84.97,46.43 U4.9
  Top 0.61: v87,39 85.97,40.03 85.97,45
  Bottom 0.61: R4.1 CT1.2 C1.2 77,35 78.05,36.05 D2.C D1.A 87.5,36.05 | 87.5,36.05 90,36.05 90.8,35.25 B1.~2 | v87,39 87.5,38.5 87.5,36.05
BUZZ
  Top 0.305: U4.24 82.38,61.97 82.35,62
  Top 0.61: R24.2 78.7,71.6 82.35,67.95 82.35,62
BV
  Top 0.305: 90.44,45 90.44,45.56 87.58,48.42 U4.13
  Top 0.61: 90.44,45 90.44,43.02 92,41.46 92,36.77 81.5,26.27 81.5,16.5 88,10 88,4 86.1,2.1 R35.1 R36.1 R30.1
CTDC
  Bottom 0.61: 90.69,27.45 B1.+ | 90.69,27.45 89.18,25.94 88.76,25.94 82.61,19.79 67.5,19.79 | 67.5,19.79 67,19.79 64.88,17.66 43.84,17.66 41.3,20.2 B4.+ | B3.+ 67.3,19.99 67.5,19.79 | R12.1 94,40.1 94,30.76 90.69,27.45
GND  (via drill 0.5)  (1 unrouted)
  Top 0.305: U4.15 88.87,57.13 89,57 | C12.1 84,54.9 84.33,55.23 U4.21
  Top 0.61: 90.12,55.28 C16.1 90.88,55.28 C8.- | SW2.P$3 48.54,12.38 46.88,14.04 43.83,14.04 42.17,12.38 SW1.P$3 34.62,12.38 | C6.1 20.5,7.5 | C6.1 20.5,7.4 R32.2 | C9.- 37.27,19.52 34.62,16.87 34.62,12.38 | 34.62,12.38 34.62,11.75 33.59,10.72 21.22,10.72 v21,10.5 20.4,9.9 C6.1 | 82.1,5.3 R36.2 82.5,8.9 C5.1 v81,9 | R34.2 v50,8.5
  Top 0.813: C19.- 39.62,67.78 C21.1
  Bottom 0.61: v50,8.5 50,9.01 | v81,9 v80.99,9.01 54.3,9.01 53.52,8.23 52.48,8.23 51.7,9.01 50,9.01 | v21,10.5 22.49,9.01 50,9.01
  other vias: 16.5,49.5 16.5,48.5 16.5,47.5 16.5,46.5 17.5,46.5 17.5,47.5 17.5,48.5 17.5,49.5 18.5,49.5 18.5,48.5 18.5,47.5 18.5,46.5 19.5,46.5 19.5,47.5 19.5,48.5 19.5,49.5 65.5,42 57.5,39.5 71.5,69.5 52.5,54.5 43.5,54.5 67.5,55 63.5,50 92,31.5 35,55 90,50 78.5,50 78,57 62,68.5 65.6,61.2 93,25.5 58.5,45.5 75.5,35.5 73.5,31.5 27,21 84,18 75.5,18.5 72,21 84,26.5 72.5,50
  pour Bottom: 5,71.5 64,71.5 64,84 96,84 96,17 5,17
  pour Top: 5,71.5 64,71.5 64,84 96,84 96,17 5,17
LED1
  Top 0.305: 82.62,45 82.62,45.25 83.03,45.66 U4.6
  Top 0.61: R1.2 29.5,24.5 31.06,22.94 40.14,22.94 45.53,17.55 53.97,17.55 54.54,18.12 67.02,18.12 82.62,33.71 82.62,45
LED2
  Top 0.305: 80.35,45 80.31,45.56 81.72,46.98 U4.4
  Top 0.61: 80.35,45 80.35,34.61 66.1,20.35 53.61,20.35 53.05,19.79 46.45,19.79 41.5,24.74 R2.2
LED3
  Top 0.305: 78.12,45 78.12,46.02 80.42,48.32 U4.2
  Top 0.61: R3.2 54.5,25 56.91,22.59 65.09,22.59 71.29,28.79 71.29,33.26 78.12,40.08 78.12,45
MAN  (1 unrouted)
  Top 0.305: 81.5,45 81.5,45.5 82.38,46.38 U4.5
  Top 0.61: 81.5,45 81.5,34.17 66.56,19.23 54.07,19.23 53.51,18.67 45.99,18.67 40.6,24.06 34.02,24.06 SW1.P$2
N$1
  Top 0.61: R28.2 R25.1
N$2
  Top 2: TR1.9 29,51.5 22.38,58.12 22.38,63.41 20.5,65.3 B2.~2
N$3
  Top 0.813: X1.1 80.27,79 80.7,78.57 D13.A 83,75.2 T1.C
N$4
  Top 0.61: R24.1 79.45,74.4 T1.B
N$5
  Top 0.61: R27.1 R30.2
N$6
  Top 0.61: R40.1 R38.1 20.1,24.5 19.45,23.85 U3.G
N$8
  Top 0.813: CR1.3 11.65,43.25 L1.1
N$9
  Top 0.61: LED3.A 60.33,27.4 57.5,27.4 55,29.9 R3.1
N$10
  Top 2: TR1.7 40.23,51.5 37.22,48.49 28.46,48.49 19.88,57.08 19.88,62.37 B2.~1
N$11
  Top 0.61: R21.1 R25.2
N$12
  Top 1: 40.5,77.5 40.5,80.5 39,82 18,82 11.44,75.44 7.36,75.44 7.3,75.5 4,75.5 1.5,73 1.5,11 5,7.5
  Top 1.016: 5,7.5 F1.2 6.9,5 R21.2
  Top 2.54: TR1.1 40.5,77.5
N$13
  Top 0.61: LED2.A 47.33,27.4 44.5,27.4 42,29.9 R2.1
N$14
  Top 0.61: R22.1 R26.2
N$15
  Top 0.61: R23.1 R27.2
N$16
  Top 0.61: OK1.1 17.5,30.73 16.1,32.13 R37.2
N$17  (3 unrouted)
  Top 0.762: 17.5,17.5 D15.A 18.5,17.5
  Top 2: RL1.1. D16.A | 18,14.75 D16.A | U3.D 18.5,17.5 18.5,15.2 D16.A
  Bottom 2: RL3.1. 75.28,14.75 72.67,17.36 68.33,17.36 65.72,14.75 RL2.1. 42.78,14.75 40.17,17.36 31.84,17.36 29.23,14.75 RL1.1.
N$18
  Top 0.61: Q1.1 14.5,22.65 14.5,25 13.9,25.6 R39.2 13.9,28.6 11.77,30.73 OK1.4
N$19
  Top 0.61: R26.1 R29.2
N$20  (3 unrouted)
  Top 0.762: D15.C 13.5,17.5
  Top 2: RL1.2 D16.C 13.5,15.2 13.5,17.5 Q1.3
  Bottom 2: RL3.2 69.41,14.75 66.81,12.14 41.7,12.14 39.09,14.75 RL2.2 32.92,14.75 30.31,12.14 25.33,12.14 22.72,14.75 RL1.2
N$21
  Bottom 0.61: U1.1 11.45,28.95 R7.1
  Bottom 0.813: R7.1 14.9,28.5 R8.2
N$22  (via drill 0.5)
  Top 1.016: R22.2 39.4,5 F2.2 v37.5,6.5
  Bottom 1: 55.5,77.5 55.5,81.43 54.5,82.43 18.43,82.43 11.44,75.44 4,75.44 1.5,73 1.5,11 6,6.5 v37.5,6.5
  Bottom 2.54: TR1.5 55.5,77.5
N$23  (via drill 0.5)
  Top 0.61: v90,31 85.5,26.5 v85.5,25
  Bottom 0.61: 74,23.1 C2.1 79.65,23.1 D3.C D4.A 84.55,25 v85.5,25 | 74,23.1 R5.2 | CT1.1 74,23.1 | B1.~1 88.2,33.05 90.01,31.24 v90,31
N$24
  Top 1.016: R23.2 71.9,5 F3.2
N$33
  Top 0.61: R1.1 30,29.4 30.33,29.4 32.5,27.23 34.5,27.23 LED1.A
N$47
  Bottom 0.61: R11.2 48,23.1 | 48,23.1 C11.1 52.4,23.1 53.05,22.45 D7.C 57.5,22.45 | CT2.1 48,23.1 | B3.~1 64.7,25.95 61.2,22.45 D8.A
  Bottom 1: D8.A 57.5,22.45
N$57
  Bottom 0.61: R13.2 R12.2 90.5,48.5 86.41,48.5 85.91,49 U2.5
N$62
  Bottom 0.61: B4.~1 38.7,26.2 35.45,22.95 D12.A D11.C 27,22.95 26.85,23.1 C15.1 22,23.1 | R20.2 22,23.1 | CT3.1 22,23.1
N$74  (via drill 0.5)
  Top 0.61: v52.5,44.5 52.45,44.55 IC1.1
  Bottom 0.61: v52.5,44.5 51.77,45.23 44.5,45.23 D17.12
N$75
  Top 0.508: D17.9 48.87,48.08 47.37,46.58 IC1.5
N$76
  Top 0.305: 45.46,48.8 45.46,47.35
  Top 0.61: 45.46,48.8 46.15,49.49 49.85,49.49 51.27,48.08 D17.8 | IC1.6 46.09,46.72 45.46,47.35
R  (1 unrouted)
  Top 1: RL1.C. 1.57,2.88
  Top 1.016: RL1.C. 2,3.05 F1.1
RA  (via drill 0.5)
  Top 0.305: 84.85,45 84.85,45.4 84.33,45.93 U4.8
  Top 0.61: v85.5,38.5 84.85,39.1 84.85,45
  Bottom 0.61: R19.1 CT3.2 C14.2 26.4,33.4 27.05,34.05 D10.C D9.A 33.85,35.9 36.08,35.9 36.45,35.53 41.5,35.53 | 41.5,35.53 47.54,35.53 47.83,35.24 52.92,35.24 53.59,35.91 58.28,35.91 61.63,39.27 84.73,39.27 v85.5,38.5 | 41.5,35.53 41.3,35.33 B4.~2
RELAY
  Top 0.305: 87.09,45 87.09,45.46 85.62,46.93 U4.10
  Top 0.61: 87.09,45 87.09,40.91 88.5,39.5 88.5,38.01 78.15,27.66 78.15,18.18 76.96,17 55,17 54.43,16.43 45.07,16.43 39.68,21.82 29.18,21.82 26.5,24.5 R38.2
RST
  Top 0.305: U4.18 86.28,59.5 88.04,61.26 88.04,63.65 SV1.2
RV
  Top 0.305: 88.21,45 88.21,45.49 86.28,47.43 U4.11
  Top 0.61: 88.21,45 88.21,42.09 89.77,40.52 89.77,37.7 79.27,27.2 79.27,17.27 72.82,10.82 35.41,10.82 34.09,9.5 23,9.5 22.5,9 22.5,2.5 22.1,2.1 R32.1 R31.2 R28.1
RXD
  Top 0.305: U4.23 83.03,61.02 83.5,61.5 83.5,61.97 83.47,62
  Top 0.61: 83.47,62 83.47,67.43 90.85,74.81 JP1.2
RXD2
  Top 0.305: U4.17 86.92,58.92 90.5,62.5 SV1.4
SCF  (via drill 0.5)
  Top 0.305: U4.28 79.78,58.73 77.88,60.62 77.88,62
  Top 0.61: 77.88,62 77.88,63.5 77.5,63.88 75.46,63.88 75.27,63.69 75.3,63 75.3,56.8 66.5,48 v66.5,44.5 | C13.+ 72.1,41.88 72.1,39.88 65.33,33.1 60.92,33.1 59.74,34.28 51.44,34.28 48.75,31.59 47.25,31.59 44.56,34.28 37.07,34.28 36.02,33.23 34.98,33.23 33.93,34.28 28,34.28 25.31,31.59 21.25,31.59 19.57,33.27 OK1.2
  Bottom 0.61: v66.5,44.5 66.5,44.78 C13.+ 78.72,48.5 82.5,48.5 83.36,49.37 U2.7
SCF_VCC
  Bottom 0.61: R14.1 R15.2 84.64,46.53 U2.6
SCK  (via drill 0.5, 0.51)
  Top 0.305: U4.25 81.72,58 81.74,58.02 81.74,60.76 81.23,61.27 81.23,62 | 80.5,68 v81,67.5
  Top 0.61: IC2.2 51.17,66.97 52.03,66.12 60.46,66.12 62.96,63.62 69.12,63.62 v72,66.5 74,68.5 80,68.5 80.5,68 | IC1.2 51.17,43.97 51.96,43.19 53.04,43.19 53.09,43.23 58.57,43.23 72,56.66 v72,61 | v81,67.5 81.23,67.27 81.23,62
  Bottom 0.61: v72,66.5 v72,61 | R43.1 83,69.5 v81,67.5
STOP  (1 unrouted)
  Top 0.305: 79.23,45 79.23,45.73 81.08,47.58 U4.3
  Top 0.61: 79.23,45 79.23,35.07 65.63,21.47 55.78,21.47 53.75,23.5 47.58,23.5 SW2.P$2
TXD
  Top 0.305: 84.58,62 84.58,61.58 83.67,60.67 U4.22
  Top 0.61: 84.58,62 84.58,66.96 89.89,72.27 JP1.3
TXD2
  Top 0.305: U4.16 87.58,58.08 93.04,63.54 SV1.6
UPDI
  Top 0.305: SV1.1 87.34,65.66 86.67,64.98 86.67,63.01 86.67,63 86.67,61.31 85.62,60.27 U4.19
V_DIS  (via drill 0.5)
  Top 0.305: 80.11,62 80.11,61.39 81.08,60.42 U4.26
  Top 0.61: IC2.3 49.91,66.66 51.56,65 60,65 62.5,62.5 70.08,62.5 74.58,67 v79,67 80.11,65.89 80.11,62
  Bottom 0.61: R42.1 80,69 79,68 v79,67
VA
  Top 0.61: IC2.8 43.55,70.44 D18.11
  Bottom 0.61: LED7.A 31.77,71.5 39.86,71.5 41,72.64 42.63,72.64 D18.11
VB  (via drill 0.5)
  Top 0.61: v40,61.5 41.49,62.99 43.28,62.99 43.55,63.27 IC2.9
  Bottom 0.61: v40,61.5 40,61.58 45.55,67.13 49.87,67.13 51.14,65.86 53.47,65.86 54.35,66.73 D18.7
VC  (via drill 0.5)
  Top 0.305: IC2.11 46.09,62.4 45.47,61.77 45.47,59.83 v45.5,59.8
  Bottom 0.61: LED11.A 63.86,66 60.36,62.5 50.85,62.5 D18.4 47.86,59.51 45.79,59.51 v45.5,59.8
VCC  (via drill 0.5)
  Top 0.305: 85.7,62 85.7,61.5 84.99,60.79 84.99,57.15 U4.20 | U4.14 88.22,51.83 88.5,52.1
  Top 0.61: IC2.10 44.83,64.17 44.4,64.6 C21.2 37.88,64.6 C19.+ | IC1.10 44.83,41.17 44.4,41.6 C20.2 40,41.22 C18.+ | 63.5,35.5 v63.5,34.5 | v35.5,34.5 35.5,35.5 | 85.7,62 85.7,66.5 88.93,69.73 90.5,69.73 | v85.8,28.6 93.12,35.92 93.12,41.93 92.5,42.55 C8.+ 92.5,51.87 94.63,54 94.63,68.6 JP1.4 90.5,69.73 | SV1.3 90.5,69.73 | R37.1 22.5,36.5 | v71.5,43 70.5,43
  Top 0.813: 37.5,35.5 63.5,35.5 66,35.5 70.5,40 70.5,43 70.5,43.1 77,49.6 C12.2 88.5,52.1 C16.2 92.12,52.1 C8.+ | 37.5,35.5 35.5,35.5 23.5,35.5 22.5,36.5 18.5,40.5 C7.+ 14.78,41.82 L1.2 | C18.+ 37.5,35.5
  Bottom 0.61: D12.C D9.C 33,29.95 35.5,32.45 v35.5,34.5 | D1.C D4.C 85.75,28.55 v85.8,28.6 | v63.5,34.5 58.95,29.95 D5.C D8.C | 82,52.36 91.86,52.36 C8.+ | 82,52.36 79.76,52.36 C17.1 | U2.8 82.09,52.26 82,52.36 | R41.2 R42.2 R43.2 87.1,73.4 90.77,69.73 JP1.4 | R14.2 81.5,43.5 81.17,43.16 71.59,43.16 v71.5,43
  Bottom 0.813: C19.+ 34.45,61.17 34.45,57.37 31.09,54 31.09,45.14 C18.+
VD  (via drill 0.5)
  Top 0.61: IC2.12 47.37,64.23 v47.1,64.5 | LED9.A 42.27,59 D18.2
  Bottom 0.61: v47.1,64.5 46.24,64.5 44.19,62.45 D18.2
VD1  (via drill 0.5)
  Top 0.61: IC2.1 52.45,67.56 v52.5,67.5
  Bottom 0.61: v52.5,67.5 51.75,68.25 44.48,68.25 D18.12
VD2
  Top 0.508: IC2.5 47.37,69.54 48.9,71.08 D18.9
VD3
  Top 0.305: 45.46,70.43 45.46,71.96 45.5,72
  Top 0.508: IC2.6 46.09,69.79 45.46,70.43
  Top 0.61: 45.5,72 46,72.5 50.39,72.5 D18.8
VD4
  Top 0.61: IC2.7 44.83,67.83 44.5,67.5 42.89,67.5 40.89,69.5 29,69.5 27.73,70.77 LED7.K | LED9.K 27.73,58.27 29.15,56.85 31.35,56.85 32.38,57.88 64.01,57.88 65.05,56.85 66.62,56.85 68.27,58.5 LED12.K
  Bottom 0.61: LED7.K LED8.K LED9.K | LED12.K LED11.K LED10.K
VDP
  Top 0.61: D18.3 48.29,59.36 52.46,59.36 53.37,60.27 53.37,62.34 52.45,63.27 IC2.16
VE  (via drill 0.5)
  Top 0.61: IC2.13 48.63,64.36 v48.6,64.5 | LED8.A 36.15,60.12 40.85,60.12 D18.1
  Bottom 0.61: D18.1 41.65,61.65 45.81,65.81 48,65.81 48.6,65.21 v48.6,64.5
VEE  (via drill 0.5)
  Top 0.762: R39.1 11.1,24.6 10.83,24.33
  Top 0.813: 12.5,71 23.11,71 26.96,74.85 31.04,74.85 34.39,71.5 39.72,71.5 40.96,72.74 44.52,72.74 45.49,73.72 50.9,73.72 51.87,72.74 55.04,72.74 56.28,71.5 61.61,71.5 64.96,74.85 72.35,74.85 75,77.5 D13.C 77.3,78.8 77.73,79.23 X1.2 | v6,33 6.72,33 | D14.C 6.72,37
  Top 1: CR1.1 7,50.28 6.72,50
  Top 1.016: 12.06,23.1 12.55,22.61 Q1.2
  Top 2: B2.+ 13.45,70.05 12.5,71 7.5,71 6.72,70.22 C3.+ C4.+ 6.72,50 6.72,37 6.72,33 6.72,28.44 10.83,24.33 12.06,23.1
  Bottom 1.016: v6,33 R6.1
VF  (via drill 0.5)
  Top 0.61: IC2.14 49.91,64.41 v50.1,64.5
  Bottom 0.61: v50.1,64.5 54.02,64.5 56.41,66.89 56.41,71.23 | D18.10 48.29,72.64 55,72.64 56.41,71.23 | LED10.A 63.96,71.23 56.41,71.23
VG
  Top 0.61: IC2.15 51.17,61.55 D18.5
  Bottom 0.61: LED12.A 63.81,60.92 D18.5
Y  (1 unrouted)
  Top 0.813: F2.1 34.5,3.05 RL2.C.
YA  (via drill 0.5)
  Top 0.305: U4.7 83.67,45.06 83.73,45
  Top 0.61: v84,38 83.73,38.21 83.73,45
  Bottom 0.61: R10.1 CT2.2 C10.2 51.1,33.5 53,33.5 53.55,34.05 D6.C D5.A 61.92,37.97 67.5,37.97 | 67.5,37.97 71,37.97 82.5,38 v84,38 | 67.5,37.97 67.3,37.77 B3.~2
YV
  Top 0.305: 89.32,45 89.32,45.53 86.92,47.93 U4.12
  Top 0.61: 89.32,45 89.32,42.56 90.88,41 90.88,37.24 80.38,26.74 80.38,16.38 73.5,9.5 56.5,9.5 56,9 56,3 55.1,2.1 R33.1 R34.1 R29.1

### Text on the board
Document: BT AQ DOL R7
Reference: BT AQ DOL R5